# EAGLE board bm812inl (EAGLE 6.6.0), part 1 of 4
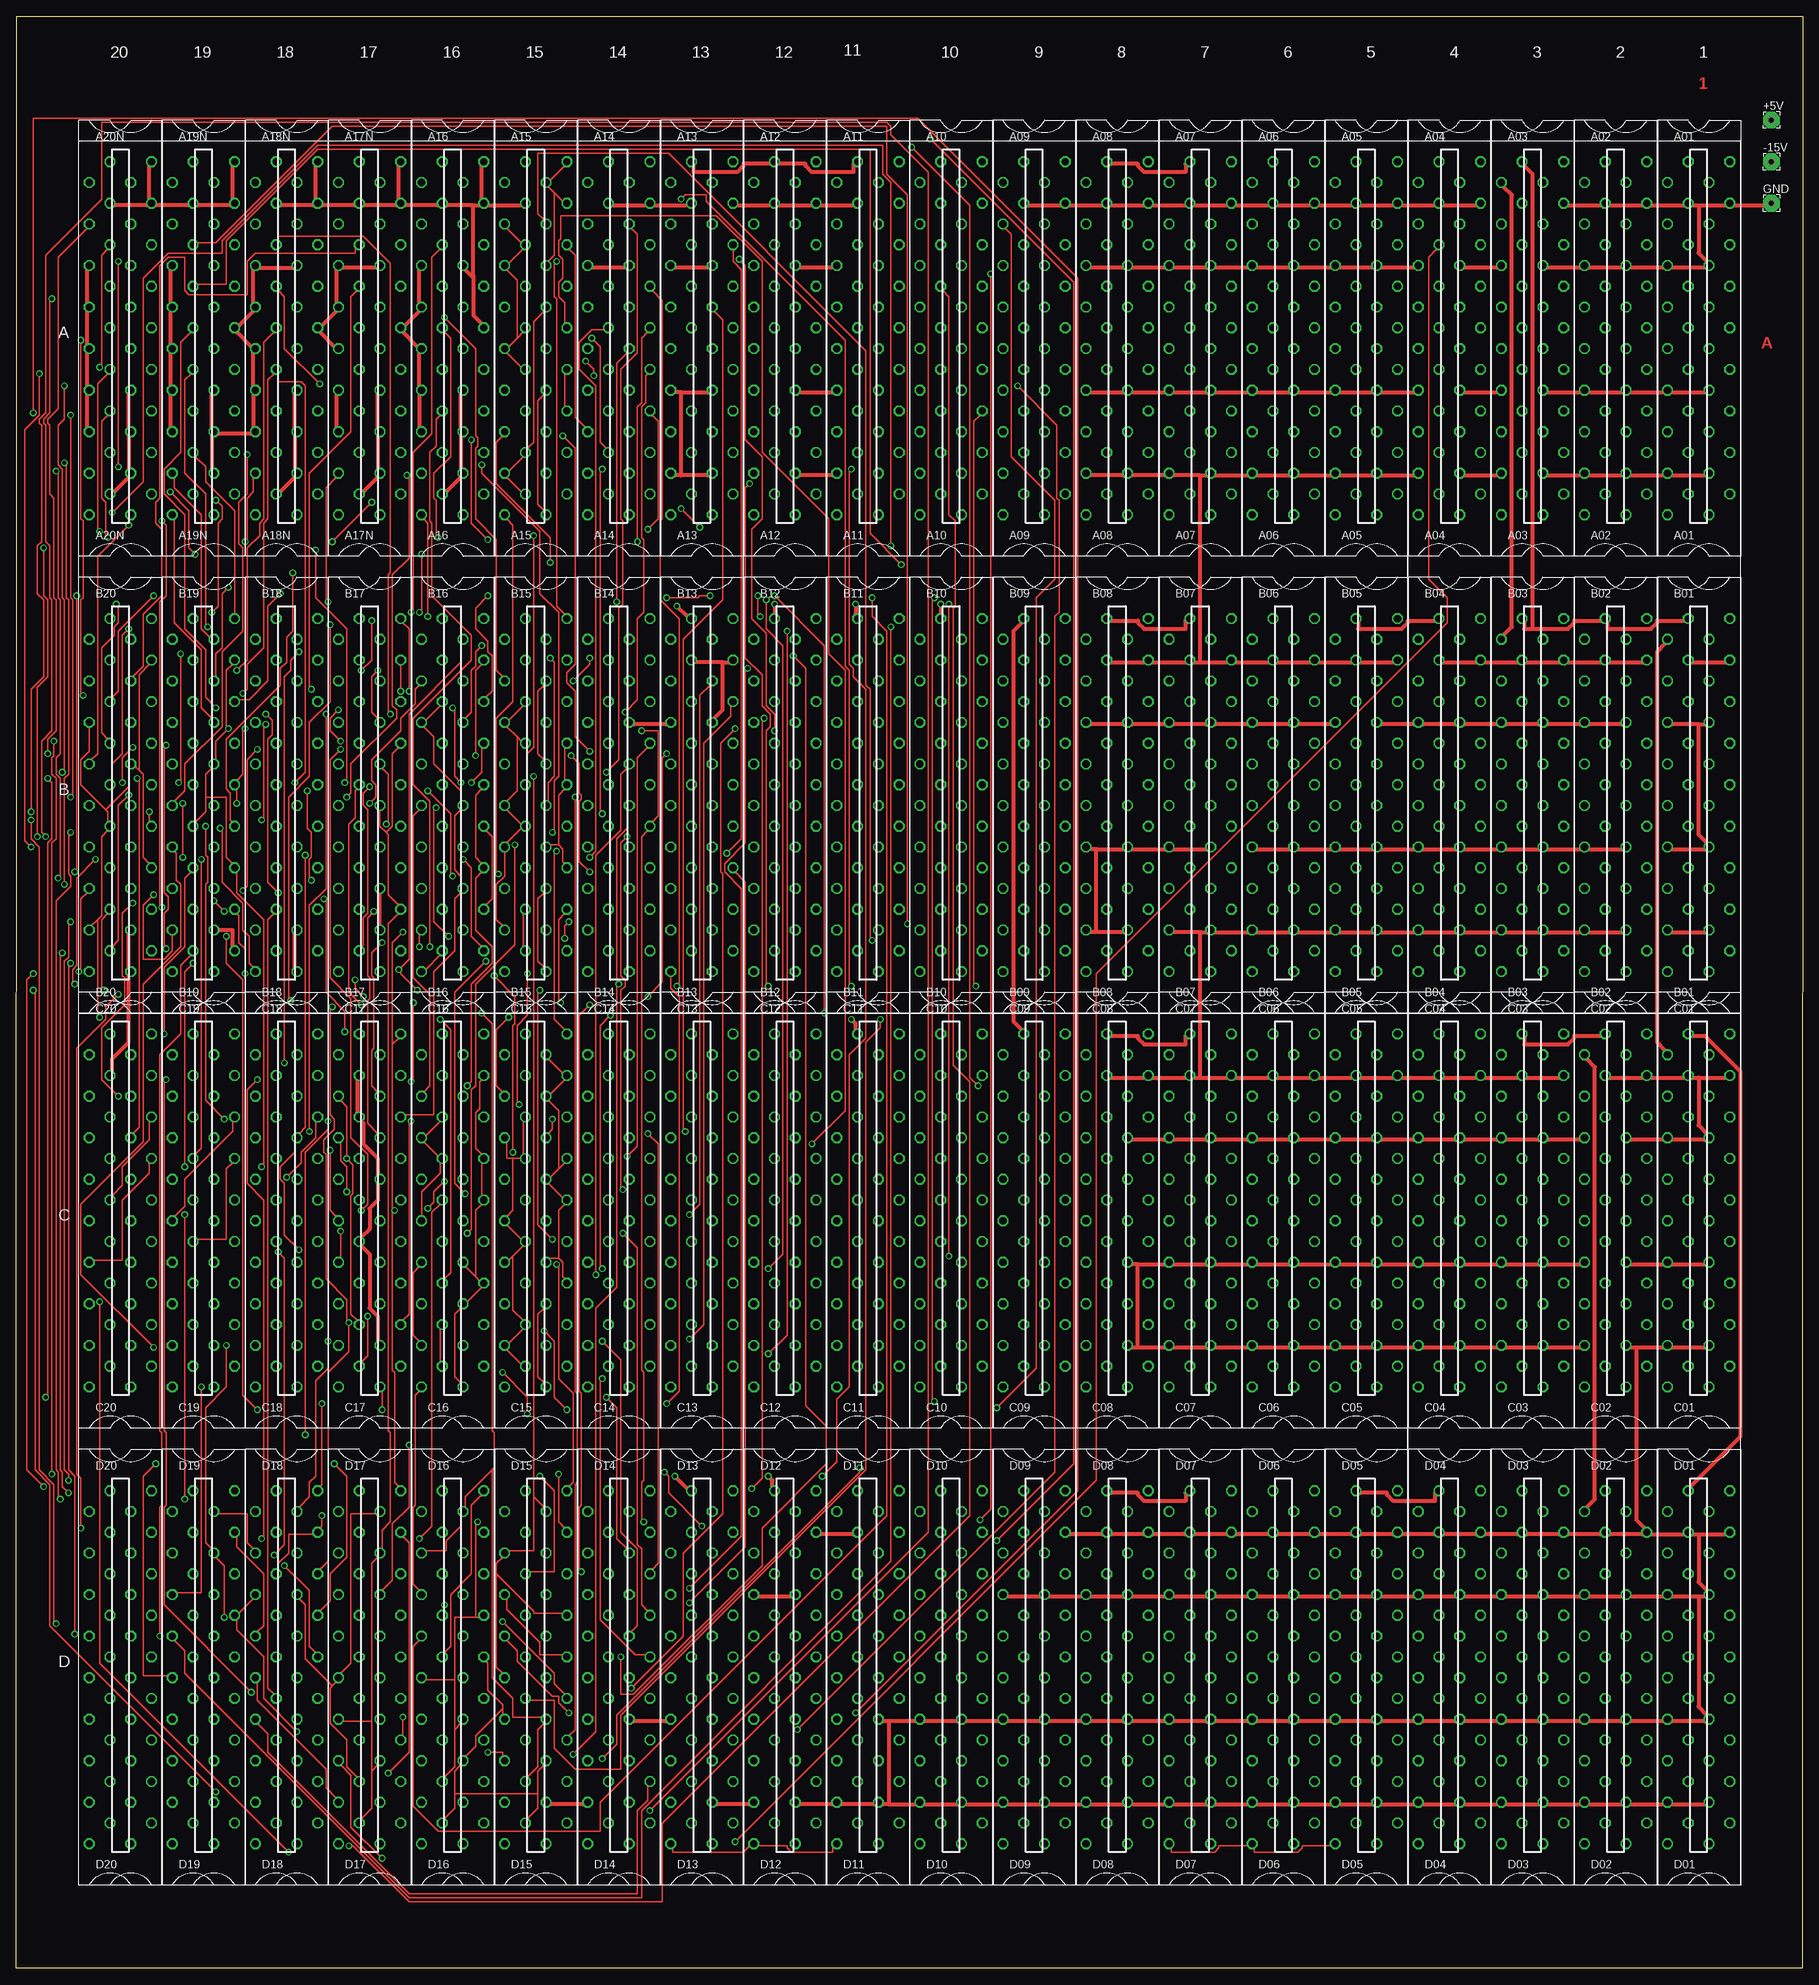
[diagram p5: board, top side]
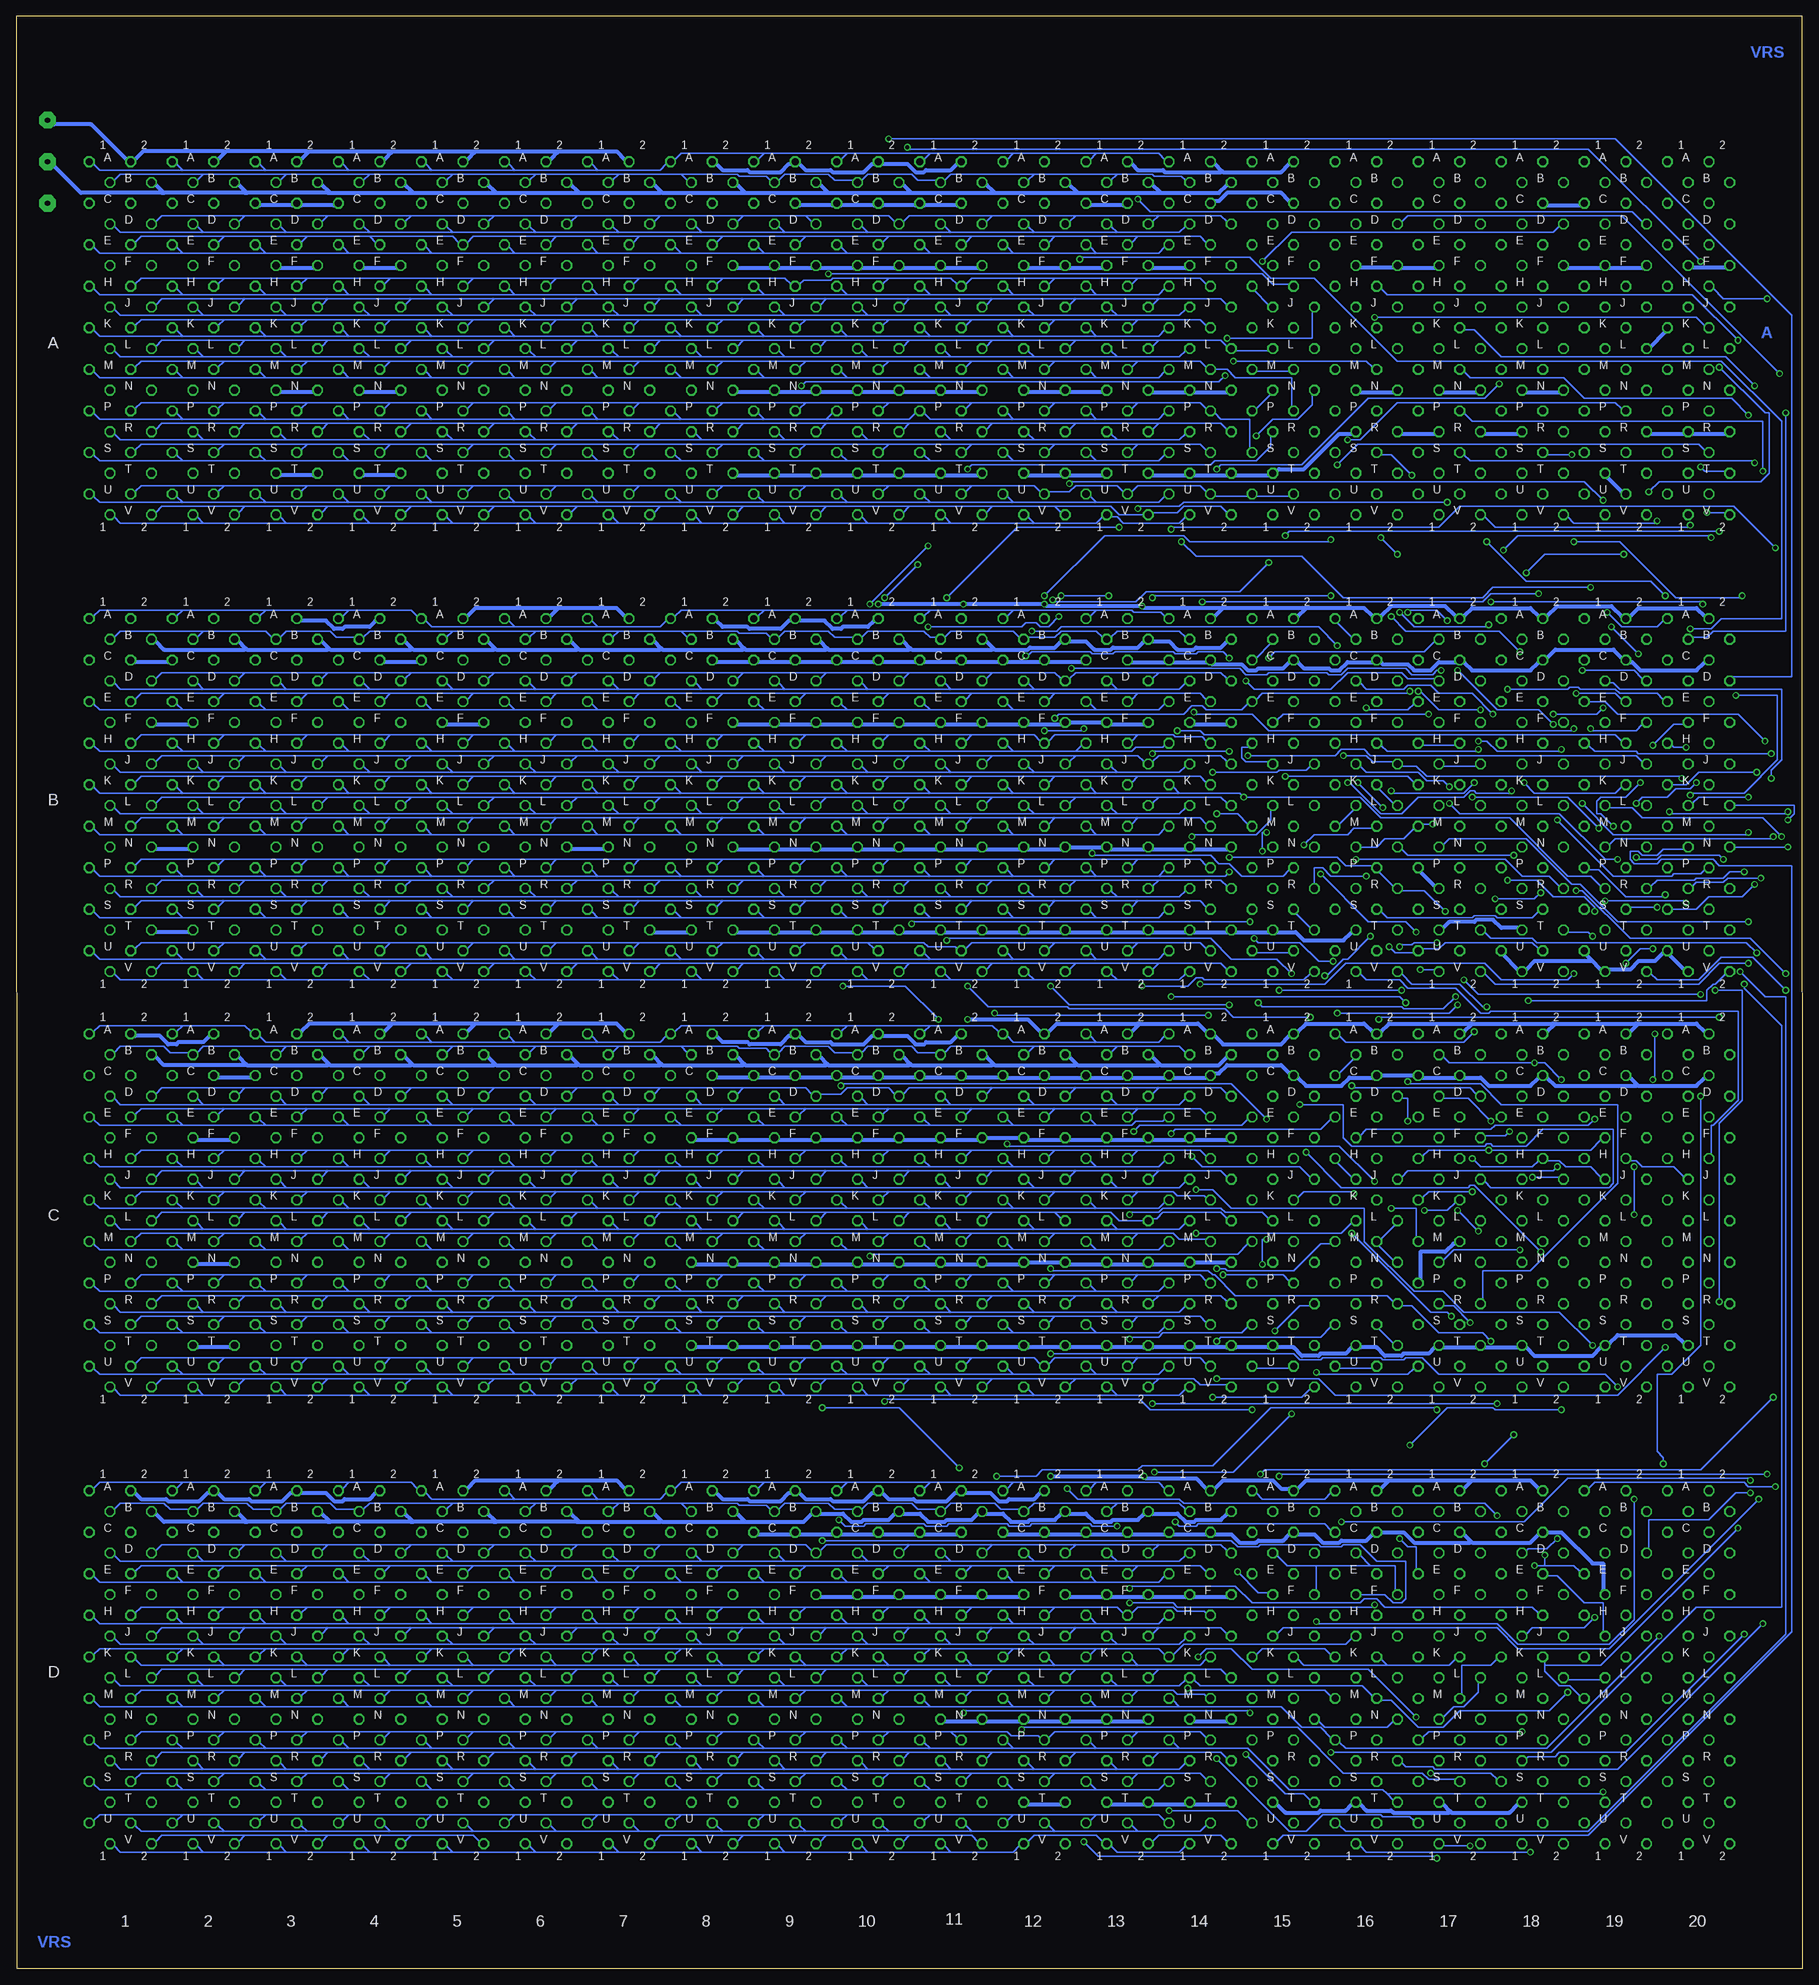
[diagram p6: board, bottom side, seen from below]

Size 273.11 x 298.44 mm. Coordinates in mm from the lower left corner, seen from the top.
Outline: 273.08,0 0,0 0.03,298.42 273.11,298.44 273.08,0
Copper layers (1*2*15*16): Top 0.035mm / dielectric 1.5mm / Route2 0.035mm / dielectric 0.15mm / Route15 0.035mm / dielectric 0.2mm / Bottom 0.035mm
Design rules "10mils": minimum track width 10mil, minimum drill 24mil, track to track 5mil, track to pad 10mil, pad to pad 10mil, via to via 5mil, smd to smd 10mil, copper to edge 40mil, drill to drill 10mil, minimum pad ring 10mil, minimum via ring 8mil, stop-mask expansion 0mil, vias tented up to drill 0mil, thermal gap 10mil
Net classes: 1 Power: width 0.635 mm

## Footprints (pad centres in the part's own frame; a part is rotated, then mirrored left to right if it is on the bottom)
2,54/0,8 = drill 0.813 pad 2.54 octagon: 1 0,0
H807 = drill 1.092 octagon: A1 4.763,28.575; A2 -1.587,28.575; B1 1.587,25.4; B2 -4.763,25.4; C1 4.763,22.225; C2 -1.587,22.225; D1 1.587,19.05; D2 -4.763,19.05; E1 4.763,15.875; E2 -1.587,15.875; F1 1.587,12.7; F2 -4.763,12.7; H1 4.763,9.525; H2 -1.587,9.525; J1 1.587,6.35; J2 -4.763,6.35; K1 4.763,3.175; K2 -1.587,3.175; L1 1.587,0; L2 -4.763,0; M1 4.763,-3.175; M2 -1.587,-3.175; N1 1.587,-6.35; N2 -4.763,-6.35; P1 4.763,-9.525; P2 -1.587,-9.525; R1 1.587,-12.7; R2 -4.763,-12.7; S1 4.763,-15.875; S2 -1.587,-15.875; T1 1.587,-19.05; T2 -4.763,-19.05; U1 4.763,-22.225; U2 -1.587,-22.225; V1 1.587,-25.4; V2 -4.763,-25.4

## Placement (x,y rotation side)
+5V  [2,54/0,8]  268.32,282.56 0 top
-15V  [2,54/0,8]  268.32,276.21 0 top
A01  M916  [H807]  257.21,247.64 0 top
A02  M916  [H807]  244.51,247.64 0 top
A03  M916  [H807]  231.81,247.64 0 top
A04  M916  [H807]  219.11,247.64 0 top
A05  M916  [H807]  206.41,247.64 0 top
A06  M916  [H807]  193.71,247.64 0 top
A07  M916  [H807]  181.01,247.64 0 top
A08  M916  [H807]  168.31,247.64 0 top
A09  M916  [H807]  155.61,247.64 0 top
A10  M916  [H807]  142.91,247.64 0 top
A11  M916  [H807]  130.21,247.64 0 top
A12  M916  [H807]  117.51,247.64 0 top
A13  M916  [H807]  104.81,247.64 0 top
A14  M916  [H807]  92.11,247.64 0 top
A15  M627  [H807]  79.41,247.64 0 top
A16  M903  [H807]  66.71,247.64 0 top
A17N  M903  [H807]  54.01,247.64 0 top
A18N  M903  [H807]  41.31,247.64 0 top
A19N  M903  [H807]  28.61,247.64 0 top
A20N  M903  [H807]  15.91,247.64 0 top
B01  M916  [H807]  257.21,177.79 0 top
B02  M916  [H807]  244.51,177.79 0 top
B03  M916  [H807]  231.81,177.79 0 top
B04  M916  [H807]  219.11,177.79 0 top
B05  M916  [H807]  206.41,177.79 0 top
B06  M916  [H807]  193.71,177.79 0 top
B07  M916  [H807]  181.01,177.79 0 top
B08  M916  [H807]  168.31,177.79 0 top
B09  M916  [H807]  155.61,177.79 0 top
B10  M916  [H807]  142.91,177.79 0 top
B11  M916  [H807]  130.21,177.79 0 top
B12  M916  [H807]  117.51,177.79 0 top
B13  M916  [H807]  104.81,177.79 0 top
B14  M916  [H807]  92.11,177.79 0 top
B15  M627  [H807]  79.41,177.79 0 top
B16  M115  [H807]  66.71,177.79 0 top
B17  M113  [H807]  54.01,177.79 0 top
B18  M623  [H807]  41.31,177.79 0 top
B19  M623  [H807]  28.61,177.79 0 top
B20  M623  [H807]  15.91,177.79 0 top
C01  M916  [H807]  257.21,114.29 0 top
C02  M916  [H807]  244.51,114.29 0 top
C03  M916  [H807]  231.81,114.29 0 top
C04  M916  [H807]  219.11,114.29 0 top
C05  M916  [H807]  206.41,114.29 0 top
C06  M916  [H807]  193.71,114.29 0 top
C07  M916  [H807]  181.01,114.29 0 top
C08  M916  [H807]  168.31,114.29 0 top
C09  M916  [H807]  155.61,114.29 0 top
C10  M916  [H807]  142.91,114.29 0 top
C11  M916  [H807]  130.21,114.29 0 top
C12  M916  [H807]  117.51,114.29 0 top
C13  M916  [H807]  104.81,114.29 0 top
C14  M916  [H807]  92.11,114.29 0 top
C15  M627  [H807]  79.41,114.29 0 top
C16  M627  [H807]  66.71,114.29 0 top
C17  M206X  [H807]  54.01,114.29 0 top
C18  M310  [H807]  41.31,114.29 0 top
C19  M310  [H807]  28.61,114.29 0 top
C20  M310  [H807]  15.91,114.29 0 top
D01  M916  [H807]  257.21,44.44 0 top
D02  M916  [H807]  244.51,44.44 0 top
D03  M916  [H807]  231.81,44.44 0 top
D04  M916  [H807]  219.11,44.44 0 top
D05  M916  [H807]  206.41,44.44 0 top
D06  M916  [H807]  193.71,44.44 0 top
D07  M916  [H807]  181.01,44.44 0 top
D08  M916  [H807]  168.31,44.44 0 top
D09  M916  [H807]  155.61,44.44 0 top
D10  M916  [H807]  142.91,44.44 0 top
D11  M916  [H807]  130.21,44.44 0 top
D12  M916  [H807]  117.51,44.44 0 top
D13  M916  [H807]  104.81,44.44 0 top
D14  M916  [H807]  92.11,44.44 0 top
D15  M206X  [H807]  79.41,44.44 0 top
D16  M206X  [H807]  66.71,44.44 0 top
D17  M206X  [H807]  54.01,44.44 0 top
D18  M111  [H807]  41.31,44.44 0 top
D19  M921  [H807]  28.61,44.44 0 top
D20  H807  [H807]  15.91,44.44 0 top
GND  [2,54/0,8]  268.32,269.86 0 top
U$1  [CBLOCK]  9.56,146.04 0 top
U$2  [CBLOCK]  60.36,146.04 0 top
U$3  [CBLOCK]  111.16,146.04 0 top
U$4  [CBLOCK]  161.96,146.04 0 top
U$5  [CBLOCK]  212.76,146.04 0 top
U$6  [CBLOCK]  9.56,12.69 0 top
U$7  [CBLOCK]  60.36,12.69 0 top
U$8  [CBLOCK]  111.16,12.69 0 top
U$9  [CBLOCK]  161.96,12.69 0 top
U$10  [CBLOCK]  212.76,12.69 0 top

## Tracks (layer width: path | path; a pad name or v marks a point on that pad's centre or on a via)
-15V
  Top 0.635: D02.B2 240.07,70.47 241.34,71.74 241.34,137.78 240.07,139.05 C02.B2 | B01.B2 252.13,202.55 250.86,201.28 250.86,141.59 252.13,140.32 C01.B2 | A03.B2 227.37,272.4 228.64,271.13 228.64,205.09 227.37,203.82 B03.B2
  Bottom 0.635: 98.3,271.61 99.41,272.72 A13.B2 | 98.3,271.61 98.14,271.45 89.25,271.45 87.98,272.72 A14.B2 | 111,271.61 110.84,271.45 98.46,271.45 98.3,271.61 | 111,271.61 112.11,272.72 A12.B2 | 123.7,271.61 123.54,271.45 111.16,271.45 111,271.61 | 123.7,271.61 124.81,272.72 A11.B2 | 136.4,271.61 136.24,271.45 123.86,271.45 123.7,271.61 | 136.4,271.61 137.51,272.72 A10.B2 | 149.1,271.61 148.94,271.45 136.56,271.45 136.4,271.61 | 149.1,271.61 150.21,272.72 A09.B2 | 161.8,271.61 161.64,271.45 149.26,271.45 149.1,271.61 | 161.8,271.61 162.91,272.72 A08.B2 | 174.5,271.61 174.34,271.45 161.96,271.45 161.8,271.61 | 174.5,271.61 175.61,272.72 A07.B2 | 187.2,271.61 187.04,271.45 174.66,271.45 174.5,271.61 | 187.2,271.61 188.31,272.72 A06.B2 | 199.9,271.61 199.74,271.45 187.36,271.45 187.2,271.61 | 199.9,271.61 201.01,272.72 A05.B2 | 212.6,271.61 212.44,271.45 200.06,271.45 199.9,271.61 | 212.6,271.61 213.71,272.72 A04.B2 | 225.3,271.61 225.14,271.45 212.76,271.45 212.6,271.61 | 225.3,271.61 226.41,272.72 A03.B2 | 238,271.61 237.84,271.45 225.46,271.45 225.3,271.61 | 238,271.61 239.11,272.72 A02.B2 | 250.7,271.61 250.54,271.45 238.16,271.45 238,271.61 | 250.7,271.61 251.81,272.72 A01.B2 | -15V.1 267.37,275.58 263.24,271.45 250.86,271.45 250.7,271.61 | B14.B2 87.98,202.87 88.94,201.92 92.75,201.92 93.06,201.6 95.6,201.6 96.87,202.87 99.41,202.87 B13.B2 100.68,202.87 101.64,201.92 105.45,201.92 105.76,201.6 108.3,201.6 109.57,202.87 112.11,202.87 B12.B2 113.38,202.87 114.34,201.92 118.15,201.92 118.46,201.6 123.54,201.6 123.7,201.76 | 123.7,201.76 124.81,202.87 B11.B2 | 136.4,201.76 136.24,201.6 123.86,201.6 123.7,201.76
  Bottom 0.635: 136.4,201.76 137.51,202.87 B10.B2 | 149.1,201.76 148.94,201.6 136.56,201.6 136.4,201.76 | 149.1,201.76 150.21,202.87 B09.B2 | 161.8,201.76 161.64,201.6 149.26,201.6 149.1,201.76 | 161.8,201.76 162.91,202.87 B08.B2 | 174.5,201.76 174.34,201.6 161.96,201.6 161.8,201.76 | 174.5,201.76 175.61,202.87 B07.B2 | 187.2,201.76 187.04,201.6 174.66,201.6 174.5,201.76 | 187.2,201.76 188.31,202.87 B06.B2 | 199.9,201.76 199.74,201.6 187.36,201.6 187.2,201.76 | 199.9,201.76 201.01,202.87 B05.B2 | 212.6,201.76 212.44,201.6 200.06,201.6 199.9,201.76 | 212.6,201.76 213.71,202.87 B04.B2 | 225.3,201.76 225.14,201.6 212.76,201.6 212.6,201.76 | 225.3,201.76 226.41,202.87 B03.B2 | 238,201.76 237.84,201.6 225.46,201.6 225.3,201.76 | 238,201.76 239.11,202.87 B02.B2 | B01.B2 251.81,202.87 250.54,201.6 238.16,201.6 238,201.76 | D14.B2 87.98,69.52 88.94,68.57 92.75,68.57 93.06,68.25 94.33,68.25 95.6,69.52 99.41,69.52 D13.B2 100.68,69.52 101.64,68.57 105.45,68.57 105.76,68.25 108.3,68.25 109.57,69.52 112.11,69.52 D12.B2 113.38,69.52 114.34,68.57 118.15,68.57 118.46,68.25 121,68.25 122.27,69.52 124.81,69.52 D11.B2 126.08,69.52 127.04,68.57 130.85,68.57 131.16,68.25 133.7,68.25 134.97,69.52 137.51,69.52 D10.B2 138.78,69.52 139.74,68.57 143.55,68.57 143.86,68.25 145.45,68.25 146.72,69.52 150.21,69.52 D09.B2 151.48,69.52 152.75,68.25 161.64,68.25 161.8,68.41 | 161.8,68.41 162.91,69.52 D08.B2 | 174.5,68.41 174.34,68.25 161.96,68.25 161.8,68.41 | 174.5,68.41 175.61,69.52 D07.B2 | 187.2,68.41 187.04,68.25 174.66,68.25 174.5,68.41 | 187.2,68.41 188.31,69.52 D06.B2 | 199.9,68.41 199.74,68.25 187.36,68.25 187.2,68.41
  Bottom 0.635: 199.9,68.41 201.01,69.52 D05.B2 | 212.6,68.41 212.44,68.25 200.06,68.25 199.9,68.41 | 212.6,68.41 213.71,69.52 D04.B2 | 225.3,68.41 225.14,68.25 212.76,68.25 212.6,68.41 | 225.3,68.41 226.41,69.52 D03.B2 | 238,68.41 237.84,68.25 225.46,68.25 225.3,68.41 | 238,68.41 239.11,69.52 D02.B2 | D01.B2 251.81,69.52 250.54,68.25 238.16,68.25 238,68.41 | 98.3,138.26 99.41,139.37 C13.B2 | 98.3,138.26 98.14,138.1 89.25,138.1 87.98,139.37 C14.B2 | 111,138.26 110.84,138.1 98.46,138.1 98.3,138.26 | 111,138.26 112.11,139.37 C12.B2 | 123.7,138.26 123.54,138.1 111.16,138.1 111,138.26 | 123.7,138.26 124.81,139.37 C11.B2 | 136.4,138.26 136.24,138.1 123.86,138.1 123.7,138.26 | 136.4,138.26 137.51,139.37 C10.B2 | 149.1,138.26 148.94,138.1 136.56,138.1 136.4,138.26 | 149.1,138.26 150.21,139.37 C09.B2 | 161.8,138.26 161.64,138.1 149.26,138.1 149.1,138.26 | 161.8,138.26 162.91,139.37 C08.B2 | 174.5,138.26 174.34,138.1 161.96,138.1 161.8,138.26 | 174.5,138.26 175.61,139.37 C07.B2 | 187.2,138.26 187.04,138.1 174.66,138.1 174.5,138.26 | 187.2,138.26 188.31,139.37 C06.B2 | 199.9,138.26 199.74,138.1 187.36,138.1 187.2,138.26 | 199.9,138.26 201.01,139.37 C05.B2 | 212.6,138.26 212.44,138.1 200.06,138.1 199.9,138.26 | 212.6,138.26 213.71,139.37 C04.B2 | 225.3,138.26 225.14,138.1 212.76,138.1 212.6,138.26 | 225.3,138.26 226.41,139.37 C03.B2 | 238,138.26 237.84,138.1 225.46,138.1 225.3,138.26 | 238,138.26 239.11,139.37 C02.B2 | C01.B2 251.81,139.37 250.54,138.1 238.16,138.1 238,138.26
A15U1
  Top 0.254: 82.27,271.45 83.54,270.18 A15.C1 | 82.27,271.45 81.32,272.4 A15.B1 81.63,273.36 83.86,275.58 A15.A1 | 82.27,271.45 82.27,261.93 81.32,260.97 A15.F1 80.68,259.7 80.68,254.62 A15.J1 80.68,253.35 79.09,251.77 79.09,233.35 78.14,232.4 A15.S2 77.51,231.13 75.28,228.9 A15.T2 74.97,227.95 77.19,225.73 A15.U2
  Bottom 0.254: A15.J1 81.63,254.3 83.86,256.53 A15.H1 | A15.U2 78.46,225.09 83.54,225.09 A15.U1 84.81,225.09 89.89,225.09 A14.U2 91.16,225.73 92.11,226.68 101.64,226.68 102.59,225.73 A13.U2 103.86,225.73 104.81,226.68 111.16,226.68 112.11,225.73 115.29,225.73 A12.U2 116.56,225.73 117.51,226.68 127.04,226.68 | 127.04,226.68 127.99,225.73 A11.U2 | 139.74,226.68 140.69,225.73 A10.U2 | 127.04,226.68 139.74,226.68 | 152.44,226.68 153.39,225.73 A09.U2 | 139.74,226.68 152.44,226.68 | 165.14,226.68 166.09,225.73 A08.U2 | 152.44,226.68 165.14,226.68 | 177.84,226.68 178.79,225.73 A07.U2 | 165.14,226.68 177.84,226.68 | 190.54,226.68 191.49,225.73 A06.U2 | 177.84,226.68 190.54,226.68 | 203.24,226.68 204.19,225.73 A05.U2 | 190.54,226.68 203.24,226.68 | 215.94,226.68 216.89,225.73 A04.U2 | 203.24,226.68 215.94,226.68 | 228.64,226.68 229.59,225.73 A03.U2 | 215.94,226.68 228.64,226.68 | 241.34,226.68 242.29,225.73 A02.U2 | 228.64,226.68 241.34,226.68 | 241.34,226.68 254.04,226.68 254.99,225.73 A01.U2
A15V1
  Top 0.254: A15.D2 74.97,266.05 77.19,263.83 A15.E2 77.51,262.88 75.28,260.66 A15.F2 74.97,259.7 76.55,258.11 76.55,249.23 | A15.M2 77.19,244.78 74.97,247 A15.L2 75.28,247.96 76.55,249.23 | 76.55,249.23 77.51,250.18 A15.K2 | A15.V1 80.68,222.87 79.73,223.83 79.73,239.7 80.68,240.65 A15.N1 | A15.M1 83.86,243.83 83.86,238.75 A15.P1
  Bottom 0.254: A15.P1 83.54,238.43 81.32,240.65 A15.N1 | A15.M2 78.46,244.14 83.54,244.14 A15.M1
B17S1
  Top 0.254: 56.55,173.66 55.6,174.61 B17.L1 | 56.55,173.66 56.87,173.34 56.87,164.14 58.46,162.55 B17.S1 58.46,161.28 56.87,159.69 56.87,82.22 57.19,81.9 57.19,68.25 55.92,66.98 55.92,64.12 D17.D1 55.28,62.85 54.33,61.9 54.33,37.77 | 56.55,173.66 57.5,174.61 57.5,185.73 58.46,186.68 B17.H1 | 54.33,30.15 54.33,24.44 52.74,22.85 D17.U2 | 54.33,30.15 55.28,31.1 D17.R1 | 54.33,37.77 49.88,37.77 D17.N2 | 54.33,30.15 54.33,37.77
  Bottom 0.254: B17.H2 53.06,186.99 58.14,186.99 B17.H1
B17V1  (via drill 0.61)
  Top 0.254: D16.A1 71.16,72.38 69.57,70.79 69.57,60.31 66.39,57.14 66.39,49.2 65.44,48.25 D16.K2 | B16.B1 67.98,202.55 67.98,199.7 60.04,191.76 60.04,154.29 v58.46,152.71 58.77,152.39 58.77,152.07 v61.31,149.53 | v82.59,107.62 82.9,107.3 82.9,90.16 85.13,87.94 85.13,74.28 84.49,73.65 D15.A1 | v81.95,111.43 79.73,113.65 79.73,149.21 v80.05,149.53
  Bottom 0.254: D16.A1 72.11,72.69 73.06,71.74 82.59,71.74 83.54,72.69 D15.A1 | 63.54,46.34 54.01,46.34 53.06,47.29 D17.K2 | 63.54,46.34 64.49,47.29 D16.K2 | 63.54,46.34 76.24,46.34 77.19,47.29 D15.K2 | v58.46,152.71 56.23,152.71 B17.V1 | B16.A1 71.16,205.73 68.93,203.51 B16.B1 | v82.59,107.62 82.59,111.43 v81.95,111.43 | v61.31,149.53 v80.05,149.53
C16U1
  Top 0.254: C16.U2 64.81,92.7 64.81,97.78 C16.S2 | C16.E2 64.81,129.53 62.58,127.3 C16.F2 62.27,126.35 64.49,124.13 C16.H2 64.81,123.18 64.81,121.59 61.95,118.73 C16.L2 | C16.T2 61.63,95.87 60.68,96.83 60.68,106.35 61.63,107.3 C16.N2
  Bottom 0.254: C16.U2 65.76,91.74 70.84,91.74 C16.U1 | C16.T2 62.58,95.55 64.81,97.78 C16.S2 | C16.N2 62.58,108.25 64.81,110.48 C16.M2 64.49,111.43 62.27,113.65 C16.L2
D01BINIT  (via drill 0.61)
  Top 0.254: v47.66,95.87 47.66,91.74 45.76,89.84 45.76,75.24 44.8,74.28 44.8,72.06 43.22,70.47 D18.B1 | v81.63,214.93 81.63,218.74 73.38,227 73.38,233.35 74.33,234.3 A15.R2 | v114.65,209.22 114.65,204.77 117.19,202.24 117.19,109.21 v114.97,106.99
  Bottom 0.254: v47.66,95.87 48.93,97.14 55.6,97.14 59.73,101.27 61.31,101.27 C16.R2 62.58,101.91 63.54,102.86 86.71,102.86 89.89,106.03 90.21,106.03 90.84,106.67 114.65,106.67 v114.97,106.99 | v81.63,214.93 86.08,210.49 100.37,210.49 101.95,208.9 114.34,208.9 v114.65,209.22
D01BTP2L  (via drill 0.61)
  Top 0.254: B16.V2 62.58,152.71 64.81,154.93 B16.U2 | D18.E1 46.39,60.95 47.66,62.22 47.66,91.11 50.84,94.28 v50.84,98.73 50.52,99.05 50.52,102.22 47.34,105.4 47.34,124.45 47.03,124.77 47.03,126.67 48.61,128.26 48.61,129.84 47.98,130.48 47.98,146.67 v48.3,146.99
  Bottom 0.254: v50.84,98.73 53.38,101.27 54.96,101.27 C17.R1 | v48.3,146.99 48.93,146.99 52.42,150.48 59.73,150.48 61.31,152.07 B16.V2
D01DEL1H  (via drill 0.61)
  Top 0.254: v18.45,181.92 18.77,181.6 18.77,128.58 17.82,127.62 C20.F1 | v70.2,185.41 70.2,198.43 71.16,199.38 B16.C1
  Bottom 0.254: v18.45,181.92 18.77,182.23 57.5,182.23 59.09,183.82 61.31,183.82 B16.J2 62.58,184.46 65.76,184.46 66.71,185.41 v70.2,185.41
D01DEL1L  (via drill 0.61)
  Top 0.254: v50.52,118.73 50.52,122.54 49.57,123.49 49.57,126.35 C17.F2 | v47.34,191.76 47.34,165.09 44.8,162.55 v44.8,127.94
  Bottom 0.254: v50.52,118.73 57.19,118.73 58.14,117.78 C17.K1 | v47.34,191.76 50.52,194.93 55.6,194.93 56.87,196.2 60.36,196.2 61,195.57 66.71,195.57 67.66,196.52 B16.D1 | v44.8,127.94 45.44,127.3 48.61,127.3 C17.F2
D01DEL2  (via drill 0.61)
  Top 0.254: v54.01,178.11 54.96,179.06 54.96,180.96 54.33,181.6 54.33,184.77 58.77,189.22 58.77,191.12 61,193.34 61,195.57 61.63,196.2 B16.D2 | v28.29,169.53 28.29,125.4 27.34,124.45 C19.H2
  Bottom 0.254: C20.J1 18.13,120.96 19.72,122.54 24.48,122.54 25.44,123.49 26.39,123.49 C19.H2 | v54.01,178.11 52.42,176.52 37.18,176.52 30.2,169.53 v28.29,169.53
D01DEL3  (via drill 0.61)
  Top 0.254: v47.98,125.08 47.98,115.88 48.93,114.92 C17.L2
  Bottom 0.254: C19.F1 30.83,126.67 32.42,125.08 v47.98,125.08 57.19,125.08 58.14,124.13 C17.H1
D01DEL4  (via drill 0.61)
  Top 0.254: B16.K1 71.16,180.33 70.2,179.37 70.2,169.85 71.16,168.9 B16.P1 71.16,167.63 70.2,166.68 70.2,158.74 72.74,156.2 72.74,153.66 69.57,150.48 69.57,135.56 v68.93,134.93 | C17.S2 52.11,99.05 51.15,100 51.15,118.1 51.47,118.41 51.47,122.86 v50.52,123.81 50.52,131.75 49.57,132.7 C17.D2
  Bottom 0.254: C19.J1 30.83,120.96 32.42,122.54 36.23,122.54 37.18,123.49 39.09,123.49 C18.H2 40.36,123.49 41.31,122.54 49.25,122.54 v50.52,123.81 | v68.93,134.93 68.62,134.61 50.84,134.61 49.88,133.65 C17.D2
D01DEL5  (via drill 0.61)
  Top 0.254: v43.22,109.84 40.99,112.07 40.99,120 40.36,120.64 40.36,122.54 42.58,124.77 42.58,126.35 C18.F1 43.22,127.62 44.17,128.58 v44.17,170.17
  Bottom 0.254: v43.22,109.84 53.38,109.84 54.96,108.25 C17.N1 | v44.17,170.17 60.36,170.17 61.31,171.12 B16.N2
D01DONEH
  Top 0.254: D18.N2 36.87,37.45 38.45,35.86 38.45,33.01 60.04,11.42 94.97,11.42 94.97,24.12 96.56,25.71 96.56,27.93 D14.S1
  Bottom 0.254: 107.99,27.29 98.46,27.29 97.51,28.25 D14.S1 | 107.99,27.29 108.94,28.25 D13.S1 | 120.69,27.29 121.64,28.25 D12.S1 | 120.69,27.29 107.99,27.29 | 133.39,27.29 134.34,28.25 D11.S1 | 133.39,27.29 120.69,27.29 | 146.09,27.29 147.04,28.25 D10.S1 | 146.09,27.29 133.39,27.29 | 158.79,27.29 159.74,28.25 D09.S1 | 158.79,27.29 146.09,27.29 | 171.49,27.29 172.44,28.25 D08.S1 | 171.49,27.29 158.79,27.29 | 184.19,27.29 185.14,28.25 D07.S1 | 184.19,27.29 171.49,27.29 | 196.89,27.29 197.84,28.25 D06.S1 | 196.89,27.29 184.19,27.29 | 209.59,27.29 210.54,28.25 D05.S1 | 209.59,27.29 196.89,27.29 | 222.29,27.29 223.24,28.25 D04.S1 | 222.29,27.29 209.59,27.29 | 234.99,27.29 235.94,28.25 D03.S1 | 234.99,27.29 222.29,27.29 | 247.69,27.29 248.64,28.25 D02.S1 | 234.99,27.29 247.69,27.29 | 247.69,27.29 260.39,27.29 261.34,28.25 D01.S1
D01DONEL
  Top 0.254: D18.M2 39.41,41.9 38.45,42.85 38.45,160.33 39.41,161.28 B18.S2
  Bottom 0.254: B16.S2 64.49,161.59 63.54,160.64 50.52,160.64 50.2,160.96 47.03,160.96 46.71,160.64 41.31,160.64 40.36,161.59 B18.S2
D01INHIBIT
  Bottom 0.254: A15.S1 84.49,232.4 84.49,236.84 88.94,236.84 89.89,237.8 A14.P2 91.16,238.43 92.11,239.38 101.64,239.38 | 101.64,239.38 102.59,238.43 A13.P2 | 114.34,239.38 115.29,238.43 A12.P2 | 101.64,239.38 114.34,239.38 | 127.04,239.38 127.99,238.43 A11.P2 | 114.34,239.38 127.04,239.38 | 139.74,239.38 140.69,238.43 A10.P2 | 127.04,239.38 139.74,239.38 | 152.44,239.38 153.39,238.43 A09.P2 | 139.74,239.38 152.44,239.38 | 165.14,239.38 166.09,238.43 A08.P2 | 152.44,239.38 165.14,239.38 | 177.84,239.38 178.79,238.43 A07.P2 | 165.14,239.38 177.84,239.38 | 190.54,239.38 191.49,238.43 A06.P2 | 177.84,239.38 190.54,239.38 | 203.24,239.38 204.19,238.43 A05.P2 | 190.54,239.38 203.24,239.38 | 215.94,239.38 216.89,238.43 A04.P2 | 203.24,239.38 215.94,239.38 | 228.64,239.38 229.59,238.43 A03.P2 | 215.94,239.38 228.64,239.38 | 241.34,239.38 242.29,238.43 A02.P2 | 228.64,239.38 241.34,239.38 | 241.34,239.38 254.04,239.38 254.99,238.43 A01.P2
D01INITL  (via drill 0.61)
  Top 0.254: 57.5,141.27 57.5,116.19 v57.82,115.88 57.5,115.56 57.5,91.43 57.82,91.11 57.82,74.28 58.46,73.65 D17.A1 | 57.5,141.27 58.46,142.23 C17.A1 | v73.7,167.31 73.38,167.63 73.38,191.12 75.92,193.66 75.92,220.65 74.97,221.6 A15.V2 | v59.09,158.42 57.5,156.83 57.5,141.27
  Bottom 0.254: v57.82,115.88 54.33,115.88 53.06,117.14 C17.K2 | v73.7,167.31 66.39,160.01 60.68,160.01 v59.09,158.42
D01LOADMDL  (via drill 0.61)
  Top 0.254: v56.55,174.93 56.87,175.25 56.87,182.55 55.92,183.5 B17.J1
  Bottom 0.254: B17.J2 49.88,183.82 54.96,183.82 B17.J1 | B16.N1 65.12,171.44 63.85,172.71 61,172.71 59.41,174.3 B17.M1 58.14,174.93 v56.55,174.93
D01MEMDONEL  (via drill 0.61)
  Top 0.254: v31.15,174.3 31.47,173.98 31.47,166.04 34.64,162.86 34.64,158.74 35.6,157.79 35.6,153.66 36.23,153.02 B18.V2 | v50.52,179.06 51.15,179.69 51.15,184.14 58.14,191.12 58.14,192.39 57.5,193.03 57.5,213.03 60.04,215.57 60.04,227.95 v59.73,228.27
  Bottom 0.254: v31.15,174.3 35.91,179.06 v50.52,179.06 | v59.73,228.27 62.9,231.45 64.49,231.45 A16.S2
D01MEMSTARTL  (via drill 0.61)
  Top 0.254: v48.61,77.14 50.52,75.24 50.52,62.85 47.98,60.31 47.98,56.18 46.39,54.6 D18.H1 | v44.17,81.58 44.17,124.77 47.66,128.26 v47.66,129.53 | v61.63,156.2 61.63,158.1 B16.T2 | v55.92,156.83 54.33,155.24 54.33,151.75 54.65,151.43 54.65,140.64 54.33,140.32 54.33,134.93 55.28,133.97 C17.D1
  Bottom 0.254: v48.61,77.14 v44.17,81.58 | v47.66,129.53 51.15,133.02 54.96,133.02 C17.D1 | v61.63,156.2 61.31,156.52 59.73,156.52 59.41,156.83 v55.92,156.83
D01POWEROK  (via drill 0.61)
  Top 0.254: v46.71,86.35 46.71,73.97 46.39,73.65 D18.A1 | v99.41,86.35 101.32,88.25 101.32,148.58 100.05,149.85 B13.V2
  Bottom 0.254: v99.41,86.35 v46.71,86.35 | 98.46,153.66 88.94,153.66 87.98,152.71 B14.V2 | 98.46,153.66 99.41,152.71 B13.V2 | 111.16,153.66 112.11,152.71 B12.V2 | 111.16,153.66 98.46,153.66 | 123.86,153.66 124.81,152.71 B11.V2 | 111.16,153.66 123.86,153.66 | 136.56,153.66 137.51,152.71 B10.V2 | 123.86,153.66 136.56,153.66 | 149.26,153.66 150.21,152.71 B09.V2 | 136.56,153.66 149.26,153.66 | 161.96,153.66 162.91,152.71 B08.V2 | 149.26,153.66 161.96,153.66 | 174.66,153.66 175.61,152.71 B07.V2 | 161.96,153.66 174.66,153.66 | 187.36,153.66 188.31,152.71 B06.V2 | 174.66,153.66 187.36,153.66 | 200.06,153.66 201.01,152.71 B05.V2 | 187.36,153.66 200.06,153.66 | 212.76,153.66 213.71,152.71 B04.V2 | 200.06,153.66 212.76,153.66 | 225.46,153.66 226.41,152.71 B03.V2 | 212.76,153.66 225.46,153.66 | 238.16,153.66 239.11,152.71 B02.V2 | 225.46,153.66 238.16,153.66 | 238.16,153.66 250.86,153.66 251.81,152.71 B01.V2
D01READH
  Top 0.254: B16.E2 64.81,193.03 62.58,190.8 B16.F2 62.27,189.85 63.85,188.27 63.85,184.14 67.98,180.01 67.98,178.42 B16.L1 67.98,177.15 67.03,176.2 67.03,167.95 67.98,166.99 67.98,165.72 B16.R1 67.98,164.45 67.03,163.5 67.03,155.56 63.85,152.39 63.85,130.48 59.41,130.48 C17.E1 | B16.S1 71.79,162.55 72.74,163.5 72.74,173.02 71.79,173.98 B16.M1
  Bottom 0.254: B16.L1 68.62,177.15 70.84,174.93 B16.M1
D01READL  (via drill 0.61)
  Top 0.254: v54.65,161.59 53.69,160.64 53.69,151.75 54.01,151.43 54.01,148.26 53.69,147.94 53.69,129.21 55.28,127.62 C17.F1 | v87.67,169.85 88.62,170.8 88.62,241.92 86.08,244.46 86.08,248.59 87.98,250.49 89.89,250.49 A14.K2
  Bottom 0.254: v54.65,161.59 57.82,164.77 61.31,164.77 B16.R2 62.58,165.4 64.81,167.63 B16.P2 65.76,168.58 69.89,168.58 71.16,169.85 v87.67,169.85 | 101.64,252.08 92.11,252.08 91.16,251.13 A14.K2 | 101.64,252.08 102.59,251.13 A13.K2 | 114.34,252.08 115.29,251.13 A12.K2 | 101.64,252.08 114.34,252.08 | 127.04,252.08 127.99,251.13 A11.K2 | 114.34,252.08 127.04,252.08 | 139.74,252.08 140.69,251.13 A10.K2 | 127.04,252.08 139.74,252.08 | 152.44,252.08 153.39,251.13 A09.K2 | 139.74,252.08 152.44,252.08 | 165.14,252.08 166.09,251.13 A08.K2 | 152.44,252.08 165.14,252.08 | 177.84,252.08 178.79,251.13 A07.K2 | 165.14,252.08 177.84,252.08 | 190.54,252.08 191.49,251.13 A06.K2 | 177.84,252.08 190.54,252.08 | 203.24,252.08 204.19,251.13 A05.K2 | 190.54,252.08 203.24,252.08 | 215.94,252.08 216.89,251.13 A04.K2 | 203.24,252.08 215.94,252.08 | 228.64,252.08 229.59,251.13 A03.K2 | 215.94,252.08 228.64,252.08 | 241.34,252.08 242.29,251.13 A02.K2 | 228.64,252.08 241.34,252.08 | 241.34,252.08 254.04,252.08 254.99,251.13 A01.K2
D01RETURN
  Top 0.254: A15.E1 84.49,262.88 85.44,261.93 85.44,237.16 87.03,235.57 A14.R2
  Bottom 0.254: 98.46,236.21 88.94,236.21 87.98,235.26 A14.R2 | 98.46,236.21 99.41,235.26 A13.R2 | 111.16,236.21 112.11,235.26 A12.R2 | 98.46,236.21 111.16,236.21 | 123.86,236.21 124.81,235.26 A11.R2 | 111.16,236.21 123.86,236.21 | 136.56,236.21 137.51,235.26 A10.R2 | 123.86,236.21 136.56,236.21 | 149.26,236.21 150.21,235.26 A09.R2 | 136.56,236.21 149.26,236.21 | 161.96,236.21 162.91,235.26 A08.R2 | 149.26,236.21 161.96,236.21 | 174.66,236.21 175.61,235.26 A07.R2 | 161.96,236.21 174.66,236.21 | 187.36,236.21 188.31,235.26 A06.R2 | 174.66,236.21 187.36,236.21 | 200.06,236.21 201.01,235.26 A05.R2 | 187.36,236.21 200.06,236.21 | 212.76,236.21 213.71,235.26 A04.R2 | 200.06,236.21 212.76,236.21 | 225.46,236.21 226.41,235.26 A03.R2 | 212.76,236.21 225.46,236.21 | 238.16,236.21 239.11,235.26 A02.R2 | 225.46,236.21 238.16,236.21 | 238.16,236.21 250.86,236.21 251.81,235.26 A01.R2
D01SELECTH  (via drill 0.61)
  Top 0.254: v61.63,65.71 63.54,67.61 63.54,115.56 64.81,116.83 C16.K2
  Bottom 0.254: v61.63,65.71 60.36,64.44 59.09,64.44 59.09,60.95 D17.E1
D01SELECTL  (via drill 0.61)
  Top 0.254: v60.04,80 60.04,70.47 57.5,67.93 57.5,59.36 55.92,57.77 D17.F1 | v36.87,85.39 34.64,87.62 34.64,151.12 32.1,153.66 v32.1,157.79
  Bottom 0.254: v60.04,80 54.33,85.71 47.34,85.71 47.03,85.39 v36.87,85.39 | v32.1,157.79 32.74,158.42 35.91,158.42 B18.T2
D01SELH  (via drill 0.61)
  Top 0.254: v56.87,29.83 60.04,33.01 60.04,65.08 59.09,66.03 D17.C1
  Bottom 0.254: v56.87,29.83 47.66,29.83 46.71,28.88 D18.S1
D01SELL  (via drill 0.61)
  Top 0.254: v8.93,51.1 8.93,75.24 7.97,76.19 7.97,153.34 v8.29,153.66
  Bottom 0.254: v8.93,51.1 27.02,33.01 37.18,33.01 37.82,32.37 41.95,32.37 42.26,32.06 D18.R1 | v8.29,153.66 12.74,153.66 15.91,150.48 47.03,150.48 48.61,152.07 B17.V2
D01SOURCE
  Bottom 0.254: A15.L1 81.63,247.32 86.71,247.32 A14.L2 87.98,247.96 88.94,248.91 98.46,248.91 | 98.46,248.91 99.41,247.96 A13.L2 | 111.16,248.91 112.11,247.96 A12.L2 | 98.46,248.91 111.16,248.91 | 123.86,248.91 124.81,247.96 A11.L2 | 111.16,248.91 123.86,248.91 | 136.56,248.91 137.51,247.96 A10.L2 | 123.86,248.91 136.56,248.91 | 149.26,248.91 150.21,247.96 A09.L2 | 136.56,248.91 149.26,248.91 | 161.96,248.91 162.91,247.96 A08.L2 | 149.26,248.91 161.96,248.91 | 174.66,248.91 175.61,247.96 A07.L2 | 161.96,248.91 174.66,248.91 | 187.36,248.91 188.31,247.96 A06.L2 | 174.66,248.91 187.36,248.91 | 200.06,248.91 201.01,247.96 A05.L2 | 187.36,248.91 200.06,248.91 | 212.76,248.91 213.71,247.96 A04.L2 | 200.06,248.91 212.76,248.91 | 225.46,248.91 226.41,247.96 A03.L2 | 212.76,248.91 225.46,248.91 | 238.16,248.91 239.11,247.96 A02.L2 | 225.46,248.91 238.16,248.91 | 238.16,248.91 250.86,248.91 251.81,247.96 A01.L2
D01STROBE
  Bottom 0.254: A15.P2 78.14,238.75 78.14,243.19 86.71,243.19 87.98,244.46 A14.M2 91.16,244.78 92.11,245.73 101.64,245.73 | 101.64,245.73 102.59,244.78 A13.M2 | 114.34,245.73 115.29,244.78 A12.M2 | 101.64,245.73 114.34,245.73 | 127.04,245.73 127.99,244.78 A11.M2 | 114.34,245.73 127.04,245.73 | 139.74,245.73 140.69,244.78 A10.M2 | 127.04,245.73 139.74,245.73 | 152.44,245.73 153.39,244.78 A09.M2 | 139.74,245.73 152.44,245.73 | 165.14,245.73 166.09,244.78 A08.M2 | 152.44,245.73 165.14,245.73 | 177.84,245.73 178.79,244.78 A07.M2 | 165.14,245.73 177.84,245.73 | 190.54,245.73 191.49,244.78 A06.M2 | 177.84,245.73 190.54,245.73 | 203.24,245.73 204.19,244.78 A05.M2 | 190.54,245.73 203.24,245.73 | 215.94,245.73 216.89,244.78 A04.M2 | 203.24,245.73 215.94,245.73 | 228.64,245.73 229.59,244.78 A03.M2 | 215.94,245.73 228.64,245.73 | 241.34,245.73 242.29,244.78 A02.M2 | 228.64,245.73 241.34,245.73 | 241.34,245.73 254.04,245.73 254.99,244.78 A01.M2
D01STROBEL  (via drill 0.61)
  Top 0.254: v63.22,156.2 63.22,178.42 60.68,180.96 60.68,191.12 69.57,200.01 69.57,203.82 63.54,209.86 63.54,220.97 63.22,221.29 63.22,231.76 64.17,232.71 64.17,236.84 64.81,237.48 A16.P2
  Bottom 0.254: B18.U2 40.36,155.88 41.31,156.83 54.65,156.83 55.6,155.88 58.14,155.88 B17.U1 59.41,155.24 62.27,155.24 v63.22,156.2
D01WRITE  (via drill 0.61)
  Top 0.254: v87.98,249.23 89.25,247.96 89.25,233.35 90.21,232.4 A14.S2
  Bottom 0.254: 101.64,233.03 92.11,233.03 91.16,232.08 A14.S2 | 101.64,233.03 102.59,232.08 A13.S2 | 114.34,233.03 115.29,232.08 A12.S2 | 101.64,233.03 114.34,233.03 | 127.04,233.03 127.99,232.08 A11.S2 | 114.34,233.03 127.04,233.03 | 139.74,233.03 140.69,232.08 A10.S2 | 127.04,233.03 139.74,233.03 | 152.44,233.03 153.39,232.08 A09.S2 | 139.74,233.03 152.44,233.03 | 165.14,233.03 166.09,232.08 A08.S2 | 152.44,233.03 165.14,233.03 | 177.84,233.03 178.79,232.08 A07.S2 | 165.14,233.03 177.84,233.03 | 190.54,233.03 191.49,232.08 A06.S2 | 177.84,233.03 190.54,233.03 | 203.24,233.03 204.19,232.08 A05.S2 | 190.54,233.03 203.24,233.03 | 215.94,233.03 216.89,232.08 A04.S2 | 203.24,233.03 215.94,233.03 | 228.64,233.03 229.59,232.08 A03.S2 | 215.94,233.03 228.64,233.03 | 241.34,233.03 242.29,232.08 A02.S2 | 228.64,233.03 241.34,233.03 | 241.34,233.03 254.04,233.03 254.99,232.08 A01.S2 | v87.98,249.23 74.97,249.23 74.97,253.35 A15.J2
D01WRITEH  (via drill 0.61)
  Top 0.254: v60.36,129.53 60.04,129.21 60.04,100 59.09,99.05 C17.S1 | B16.L2 61.63,177.15 60.68,176.2 60.68,151.43 63.22,148.89 63.22,134.93 62.27,133.97 C16.D2
  Bottom 0.254: B16.L2 62.58,178.11 64.81,180.33 B16.K2 | v60.36,129.53 60.36,133.02 61.31,133.02 C16.D2
D02MEM0
  Top 0.254: B20.D1 17.82,197.47 19.4,199.06 19.4,207 22.26,209.86 22.26,220.02 21.31,220.97 21.31,224.14 21.94,224.78 21.94,260.34 23.21,261.61 25.75,261.61 25.75,256.53 26.39,255.89 35.28,255.89 35.28,260.97 36.55,262.24 51.79,262.24 51.79,263.19 A17N.E2
D02MEM1  (via drill 0.61)
  Top 0.254: v45.12,195.57 44.8,195.89 44.8,228.59 51.15,234.94 51.15,255.58 52.11,256.53 A17N.H2
  Bottom 0.254: v45.12,195.57 35.91,195.57 35.6,195.89 34.33,195.89 34.01,195.57 28.61,195.57 27.98,194.93 22.26,194.93 21.31,193.98 B20.E1
D02MEM2  (via drill 0.61)
  Top 0.254: v7.02,182.87 7.34,183.18 7.34,209.22 7.02,209.54 7.02,229.22 6.39,229.86 6.39,235.89 7.34,236.84 v7.34,241.92
  Bottom 0.254: v7.02,182.87 15.91,182.87 17.82,180.96 B20.K1 | v7.34,241.92 11.78,246.37 46.07,246.37 50.2,250.49 51.79,250.49 A17N.K2
D02MEM3  (via drill 0.61)
  Top 0.254: v8.29,179.06 8.61,179.37 8.61,209.22 8.29,209.54 v8.29,237.48
  Bottom 0.254: v8.29,179.06 15.91,179.06 16.86,178.11 B20.L1 | v8.29,237.48 10.83,240.02 33.37,240.02 36.55,243.19 50.84,243.19 51.79,244.14 A17N.M2
D02MEM4  (via drill 0.61)
  Top 0.254: v6.39,166.68 6.7,166.99 6.7,181.92 6.07,182.55 6.07,185.09 6.7,185.73 6.7,209.22 6.39,209.54 6.39,228.59 v6.07,228.9
  Bottom 0.254: v6.39,166.68 11.47,166.68 12.1,166.04 16.23,166.04 16.86,165.4 B20.R1 | v6.07,228.9 6.07,236.52 50.52,236.52 51.79,237.8 A17N.P2
D02MEM5  (via drill 0.61)
  Top 0.254: v7.34,165.72 7.34,181.92 7.97,182.55 7.97,209.22 7.66,209.54 7.66,229.86 v7.34,230.18
  Bottom 0.254: v7.34,165.72 9.24,163.82 14.32,163.82 16.23,161.91 B20.S1 | v7.34,230.18 7.66,230.49 50.84,230.49 51.79,231.45 A17N.S2
D02MEM6  (via drill 0.61)
  Top 0.254: v15.28,208.58 15.59,208.27 15.59,205.73 14.96,205.09 14.96,203.82 13.05,201.92 13.05,188.9 14.01,187.95 B20.H2 | v47.66,208.9 47.34,209.22 47.34,226.36 48.93,227.95 A17N.T2
  Bottom 0.254: v15.28,208.58 15.59,208.9 v47.66,208.9
D02MEM7  (via drill 0.61)
  Top 0.254: v17.18,220.65 12.42,215.89 12.42,185.73 11.47,184.77 B20.J2
  Bottom 0.254: v17.18,220.65 17.5,220.33 47.03,220.33 48.61,221.92 A17N.V2
D02MEM8  (via drill 0.61)
  Top 0.254: v2.26,171.44 1.31,172.39 1.31,235.26 3.53,237.48 v3.53,243.83
  Bottom 0.254: v3.53,243.83 27.66,267.96 60.36,267.96 61.31,267 A16.D2 | v2.26,171.44 B20.N2
D02MEM9  (via drill 0.61)
  Top 0.254: v37.5,175.56 37.82,175.88 37.82,189.85 v38.14,190.17 | v52.74,198.43 54.33,200.01 v54.33,206.05 | v60.36,207.31 60.68,207.63 60.68,231.76 63.54,234.62 63.54,261.61 64.81,262.88 A16.E2
  Bottom 0.254: v37.5,175.56 28.93,166.99 20.04,166.99 19.72,167.31 15.59,167.31 14.96,167.95 B20.P2 | v38.14,190.17 40.36,192.39 46.71,192.39 v52.74,198.43 | v54.33,206.05 55.92,207.63 60.04,207.63 v60.36,207.31
D02MEM10  (via drill 0.61)
  Top 0.254: v17.18,179.37 15.59,177.79 15.59,157.15 14.64,156.2 B20.U2 | v10.2,194.61 9.88,194.93 9.88,209.22 10.2,209.54 10.2,221.29 9.88,221.6 v9.88,248.91
  Bottom 0.254: v17.18,179.37 16.86,179.69 8.93,179.69 3.85,184.77 3.85,194.61 v10.2,194.61 | v9.88,248.91 16.86,255.89 63.54,255.89 64.49,256.85 A16.H2
D02MEM11  (via drill 0.61)
  Top 0.254: v41.95,147.94 41.63,148.26 41.63,179.06 44.8,182.23 44.8,190.49 47.98,193.66 v47.98,205.41 | v61.63,207.31 61.95,207.63 v61.95,216.21 | v64.49,218.74 64.17,219.06 64.17,224.46 63.85,224.78 63.85,228.59 66.39,231.13 66.39,249.23 65.44,250.18 A16.K2
  Bottom 0.254: v41.95,147.94 14.64,147.94 14.64,149.53 13.69,150.48 13.37,150.48 11.78,152.07 B20.V2 | v47.98,205.41 48.3,205.09 59.41,205.09 v61.63,207.31 | v61.95,216.21 v64.49,218.74
D03BEMA0L  (via drill 0.61)
  Top 0.254: v89.57,32.06 91.79,34.28 91.79,38.72 128.94,75.87 v128.94,76.5 | v149.9,85.71 155.93,91.74 155.93,209.54 158.79,212.39 158.79,224.46 152.12,231.13 152.12,265.1 151.17,266.05 A09.D2
  Bottom 0.254: 98.46,267.96 88.94,267.96 87.98,267 A14.D2 | 98.46,267.96 99.41,267 A13.D2 | 111.16,267.96 112.11,267 A12.D2 | 111.16,267.96 98.46,267.96 | 123.86,267.96 124.81,267 A11.D2 | 123.86,267.96 111.16,267.96 | 123.86,267.96 136.56,267.96 137.51,267 A10.D2 138.78,267 139.74,267.96 152.44,267.96 | v89.57,32.06 78.46,20.94 75.92,20.94 73.38,23.48 64.49,23.48 64.17,23.16 60.04,23.16 59.41,22.53 D17.U1 | v128.94,76.5 138.15,85.71 v149.9,85.71 | 161.96,267.96 162.91,267 A08.D2 | 161.96,267.96 152.44,267.96 | 152.44,267.96 151.48,267 A09.D2 | 174.66,267.96 175.61,267 A07.D2 | 174.66,267.96 161.96,267.96 | 187.36,267.96 188.31,267 A06.D2 | 187.36,267.96 174.66,267.96 | 200.06,267.96 201.01,267 A05.D2 | 200.06,267.96 187.36,267.96 | 212.76,267.96 213.71,267 A04.D2 | 212.76,267.96 200.06,267.96 | 225.46,267.96 226.41,267 A03.D2 | 225.46,267.96 212.76,267.96 | 238.16,267.96 239.11,267 A02.D2 | 238.16,267.96 225.46,267.96 | 238.16,267.96 250.86,267.96 251.81,267 A01.D2
D03BEMA1L  (via drill 0.61)
  Top 0.254: v55.92,16.82 51.15,21.58 51.15,29.51 49.57,31.1 D17.R2 | v109.89,19.35 165.14,74.6 165.14,152.07 218.79,205.73 218.79,209.54 215.94,212.39 215.94,261.61 217.21,262.88 A04.E2
  Bottom 0.254: 101.64,264.78 92.11,264.78 91.16,263.83 A14.E2 | 101.64,264.78 102.59,263.83 A13.E2 | 114.34,264.78 115.29,263.83 A12.E2 | 114.34,264.78 101.64,264.78 | 127.04,264.78 127.99,263.83 A11.E2 | 127.04,264.78 114.34,264.78 | 139.74,264.78 140.69,263.83 A10.E2 | 139.74,264.78 127.04,264.78 | 152.44,264.78 153.39,263.83 A09.E2 | 152.44,264.78 139.74,264.78 | 165.14,264.78 166.09,263.83 A08.E2 | 165.14,264.78 152.44,264.78 | 177.84,264.78 178.79,263.83 A07.E2 | 177.84,264.78 165.14,264.78 | 190.54,264.78 191.49,263.83 A06.E2 | 190.54,264.78 177.84,264.78 | 190.54,264.78 203.24,264.78 204.19,263.83 A05.E2 205.46,263.83 206.41,264.78 219.11,264.78 | v55.92,16.82 56.23,17.13 107.67,17.13 v109.89,19.35 | 228.64,264.78 229.59,263.83 A03.E2 | 228.64,264.78 219.11,264.78 | 219.11,264.78 218.16,263.83 A04.E2 | 241.34,264.78 242.29,263.83 A02.E2 | 241.34,264.78 228.64,264.78 | 241.34,264.78 254.04,264.78 254.99,263.83 A01.E2
D03BEMA2L  (via drill 0.61)
  Top 0.254: v50.84,18.72 51.47,18.72 60.04,10.15 98.78,10.15 98.78,22.21 145.77,69.2 145.77,135.56 143.23,138.1 143.23,207.95 143.55,208.27 143.55,221.29 142.59,222.24 142.59,255.58 141.64,256.53 A10.H2
  Bottom 0.254: 165.14,258.43 155.61,258.43 154.66,257.48 A09.H2 153.39,257.48 152.75,258.11 148.63,258.11 148.31,258.43 139.74,258.43 | 165.14,258.43 166.09,257.48 A08.H2 | 177.84,258.43 178.79,257.48 A07.H2 | 177.84,258.43 165.14,258.43 | 190.54,258.43 191.49,257.48 A06.H2 | 190.54,258.43 177.84,258.43 | 203.24,258.43 204.19,257.48 A05.H2 | 203.24,258.43 190.54,258.43 | 215.94,258.43 216.89,257.48 A04.H2 | 215.94,258.43 203.24,258.43 | 228.64,258.43 229.59,257.48 A03.H2 | 228.64,258.43 215.94,258.43 | 241.34,258.43 242.29,257.48 A02.H2 | 241.34,258.43 228.64,258.43 | 241.34,258.43 254.04,258.43 254.99,257.48 A01.H2 | 101.64,258.43 92.11,258.43 91.16,257.48 A14.H2 | 101.64,258.43 102.59,257.48 A13.H2 | 114.34,258.43 115.29,257.48 A12.H2 | 114.34,258.43 101.64,258.43 | 114.34,258.43 127.04,258.43 127.99,257.48 A11.H2 129.26,257.48 130.21,258.43 139.74,258.43 | v50.84,18.72 54.96,18.72 D17.V1 | 139.74,258.43 140.69,257.48 A10.H2
D03BMA0  (via drill 0.61)
  Top 0.254: v65.44,252.4 70.2,247.64 70.2,234.3 70.52,233.99 70.52,232.71 70.2,232.4 70.2,221.6 73.38,218.43 73.38,198.43 74.33,197.47 B15.D2
  Bottom 0.254: v65.44,252.4 16.23,252.4 14.96,251.13 A20N.K2
D03BMA1  (via drill 0.61)
  Top 0.254: v79.09,219.06 79.09,186.68 78.14,185.73 78.14,181.6 B15.K2 | v12.74,219.7 12.42,220.02 12.42,242.24 14.01,243.83 A20N.M2
  Bottom 0.254: v79.09,219.06 78.46,219.7 v12.74,219.7
D03BMA2  (via drill 0.61)
  Top 0.254: v66.71,166.99 66.39,167.31 66.39,176.52 v62.9,180.01 | v50.2,181.28 50.52,181.6 50.52,204.77 45.76,209.54 v45.76,216.84 | v14.01,218.74 13.69,219.06 13.69,224.14 13.05,224.78 13.05,236.52 14.01,237.48 A20N.P2
  Bottom 0.254: v66.71,166.99 72.11,166.99 73.38,168.26 74.65,168.26 B15.R2 | v62.9,180.01 62.58,179.69 51.79,179.69 v50.2,181.28 | v45.76,216.84 43.53,219.06 14.32,219.06 v14.01,218.74
D03BMA3  (via drill 0.61)
  Top 0.254: v82.59,170.8 82.27,170.49 82.27,145.08 83.86,143.5 C15.A1 | v81.95,173.66 82.27,173.98 82.27,181.6 82.9,182.23 82.9,207.31 80.05,210.17 80.05,219.7 71.16,228.59 v71.16,229.86
  Bottom 0.254: v82.59,170.8 82.59,173.66 v81.95,173.66 | v71.16,229.86 67.98,233.03 15.91,233.03 14.96,232.08 A20N.S2
D03BMA4  (via drill 0.61)
  Top 0.254: v81.95,129.84 81.95,128.26 81.32,127.62 C15.F1 | v147.04,134.93 145.77,136.2 145.77,269.55 v136.88,278.43 | v15.59,260.97 v15.59,229.54
  Bottom 0.254: v81.95,129.84 87.35,135.24 146.72,135.24 v147.04,134.93 | v136.88,278.43 136.56,278.12 32.74,278.12 v15.59,260.97 | v15.59,229.54 14.96,228.9 11.78,228.9 A20N.T2
D03BMA5  (via drill 0.61)
  Top 0.254: v14.64,222.55 19.4,227.32 19.4,258.43 23.21,262.24 31.47,262.24 31.47,264.15 46.07,278.75 132.43,278.75 132.43,274.31 133.7,273.04 v133.7,217.48 | v142.59,208.58 v142.59,108.89
  Bottom 0.254: v14.64,222.55 11.78,222.55 A20N.V2 | v133.7,217.48 v142.59,208.58 | v142.59,108.89 142.28,109.21 86.4,109.21 84.81,110.8 C15.M1
D03BMA6  (via drill 0.61)
  Top 0.254: v101.64,270.5 102.27,271.13 105.45,271.13 105.45,270.18 126.72,248.91 126.72,199.06 127.35,198.43 127.35,150.48 v127.67,150.17 | v75.28,145.4 73.38,143.5 73.38,134.93 74.33,133.97 C15.D2
  Bottom 0.254: v101.64,270.5 99.73,268.59 26.07,268.59 24.48,267 A19N.D2 | v127.67,150.17 124.5,146.99 112.43,146.99 112.11,146.67 88.3,146.67 87.03,145.4 v75.28,145.4
D03BMA7  (via drill 0.61)
  Top 0.254: v136.24,159.69 136.24,271.13 133.07,274.31 133.07,281.61 48.3,281.61 30.52,263.83 27.66,263.83 A19N.E2 | v84.49,160.01 83.86,159.37 v83.86,157.47 | v71.79,153.98 67.03,149.21 67.03,120 v68.62,118.41
  Bottom 0.254: v136.24,159.69 135.93,160.01 v84.49,160.01 | v83.86,157.47 83.22,156.83 76.87,156.83 74.01,153.98 v71.79,153.98 | v68.62,118.41 68.93,118.73 76.24,118.73 77.19,117.78 C15.K2
D03BMA8  (via drill 0.61)
  Top 0.254: v135.29,214.62 130.53,219.38 130.53,278.12 46.07,278.12 32.1,264.15 32.1,257.48 27.66,257.48 A19N.H2 | v140.37,209.54 140.05,209.22 140.05,86.98 v140.37,86.66 | v84.17,85.39 82.27,87.3 82.27,95.87 v80.68,97.46
  Bottom 0.254: v135.29,214.62 v140.37,209.54 | v140.37,86.66 140.05,86.98 101.32,86.98 99.73,85.39 v84.17,85.39 | v80.68,97.46 76.87,101.27 75.28,101.27 C15.R2
D03BMA9  (via drill 0.61)
  Top 0.254: v30.52,192.71 28.93,194.3 28.93,201.6 25.75,204.77 25.75,222.24 22.58,225.41 22.58,229.22 25.12,231.76 25.12,248.59 26.71,250.18 A19N.K2 | v38.14,191.76 39.09,190.8 39.09,188.58 38.45,187.95 38.45,166.04 v40.04,164.45 | v47.03,163.5 47.34,163.18 47.34,149.21 50.2,146.36 v50.2,143.18
  Bottom 0.254: v30.52,192.71 31.47,191.76 v38.14,191.76 | v40.04,164.45 40.99,163.5 v47.03,163.5 | v50.2,143.18 51.79,141.59 69.89,141.59 70.84,142.55 C16.A1
D03BMA10  (via drill 0.61)
  Top 0.254: v29.25,205.09 28.93,205.41 28.93,225.41 25.75,228.59 25.75,242.87 26.71,243.83 A19N.M2 | v25.12,200.96 25.12,181.6 v24.8,181.28 | v28.93,174.61 28.93,170.17 29.25,169.85 29.25,166.04 28.93,165.72 28.93,132.7 v31.79,129.84
  Bottom 0.254: v29.25,205.09 v25.12,200.96 | v24.8,181.28 27.02,179.06 30.83,179.06 31.47,178.42 31.47,176.52 30.83,176.52 v28.93,174.61 | v31.79,129.84 32.74,128.89 47.03,128.89 47.66,128.26 66.71,128.26 67.66,127.3 C16.F1
D03BMA11  (via drill 0.61)
  Top 0.254: v69.57,233.67 69.57,220.97 v72.11,218.43 | v115.92,209.86 123.54,202.24 v123.54,146.04 | v90.84,145.72 89.25,144.13 89.25,107.3 v89.57,106.99
  Bottom 0.254: v69.57,233.67 67.66,233.67 61.95,239.38 28.61,239.38 27.66,238.43 A19N.P2 | v72.11,218.43 72.43,218.11 93.7,218.11 94.65,219.06 106.72,219.06 v115.92,209.86 | v123.54,146.04 123.23,145.72 v90.84,145.72 | v89.57,106.99 88.3,106.99 87.98,106.67 77.82,106.67 73.7,110.8 72.11,110.8 C16.M1
D03BTP2  (via drill 0.61)
  Top 0.254: v37.5,65.71 37.82,66.03 37.82,117.46 35.28,120 35.28,134.29 v36.87,135.88 | v62.9,206.68 62.9,220.97 62.27,221.6 A16.V2 | v43.22,201.28 41.95,200.01 41.95,198.43 40.99,197.47 v40.99,138.42
  Bottom 0.254: v37.5,65.71 39.09,64.12 41.95,64.12 42.26,63.81 D18.D1 | v36.87,135.88 39.41,138.42 v40.99,138.42 54.01,138.42 54.96,139.37 C17.B1 | v62.9,206.68 60.68,204.46 46.39,204.46 v43.22,201.28
D03EA0  (via drill 0.61)
  Top 0.254: v82.59,260.97 82.27,260.66 82.27,255.58 82.59,255.26 82.59,208.27 83.86,207 B15.A1
  Bottom 0.254: v82.59,260.97 78.14,265.42 38.14,265.42 37.18,266.37 A18N.D2
D03EA1  (via drill 0.61)
  Top 0.254: v57.19,191.76 56.87,192.08 56.87,213.03 57.19,213.35 57.19,260.66 53.06,264.78 40.04,264.78 40.04,264.15 A18N.E2
  Bottom 0.254: v57.19,191.76 79.41,191.76 80.36,190.8 B15.F1
D03EA2  (via drill 0.61)
  Top 0.254: v89.57,176.52 89.25,176.83 89.25,228.9 v89.57,229.22 | v46.39,242.24 40.99,247.64 40.99,255.58 40.04,256.53 A18N.H2
  Bottom 0.254: v89.57,176.52 86.4,176.52 84.81,174.93 B15.M1 | v89.57,229.22 88.94,229.86 76.55,229.86 66.39,240.02 48.61,240.02 v46.39,242.24
D03EMA0H  (via drill 0.61)
  Top 0.254: D18.F2 36.23,56.5 34.01,54.28 D19.H1 33.69,53.33 33.69,51.74 37.82,47.61 37.82,41.26 v42.9,36.18 | v85.13,196.84 87.67,199.38 v87.67,200.33 | v118.78,200.65 120.69,198.74 120.69,86.03 123.86,82.86 123.86,77.14 114.02,67.3 114.02,61.58 94.33,41.9 92.43,41.9 v92.43,47.61 | v59.09,38.4 59.09,35.55 D17.P1
  Bottom 0.254: v42.9,36.18 57.19,36.18 58.14,35.23 D17.P1 | v85.13,196.84 83.86,195.57 72.11,195.57 69.57,198.11 61.31,198.11 60.36,197.15 56.23,197.15 B17.D1 | v87.67,200.33 88.62,201.28 92.43,201.28 92.75,200.96 95.92,200.96 96.24,201.28 105.13,201.28 105.45,200.96 108.62,200.96 108.94,201.28 117.83,201.28 118.46,200.65 v118.78,200.65 | v92.43,47.61 91.16,48.88 87.35,48.88 84.17,45.71 66.39,45.71 v59.09,38.4
D03EMA0L  (via drill 0.61)
  Top 0.254: D18.E2 40.04,60.95 40.04,61.9 41.63,63.49 41.63,66.35 45.44,66.35 D18.C1 46.39,67.3 46.71,67.61 v46.71,69.2 | v60.04,195.25 60.04,204.77 59.09,205.73 B17.A1 | v112.43,73.33 114.02,74.92 114.02,190.8 v114.34,191.12
  Bottom 0.254: D19.J1 30.52,51.42 30.52,55.87 33.37,55.87 37.5,60 39.09,60 D18.E2 | v60.04,195.25 60.36,194.93 82.59,194.93 83.54,193.98 B15.E1 84.81,193.34 85.76,192.39 91.16,192.39 91.79,193.03 93.38,193.03 94.65,191.76 113.7,191.76 v114.34,191.12 | v46.71,69.2 48.61,71.11 94.65,71.11 95.29,71.74 110.84,71.74 v112.43,73.33
D03EMA1H  (via drill 0.61)
  Top 0.254: v40.99,61.58 44.8,57.77 44.8,49.2 45.76,48.25 D18.K1 | v66.71,192.71 67.03,192.39 67.03,182.23 v67.98,181.28 | v64.17,177.47 63.85,177.15 63.85,160.01 v66.08,157.79 | v73.06,151.75 76.24,148.58 76.24,144.45 75.92,144.13 v75.92,124.77 | v40.04,109.52 40.99,108.57 40.99,64.76 v39.41,63.17
  Bottom 0.254: 39.41,61.58 v40.99,61.58 | 39.41,61.58 34.96,61.58 34.01,60.63 D19.E1 | D17.M2 52.11,41.9 52.11,46.34 47.66,46.34 46.71,47.29 D18.K1 | v66.71,192.71 66.39,192.39 60.36,192.39 59.41,193.34 B17.E1 | v67.98,181.28 v64.17,177.47 | v66.08,157.79 69.57,154.29 70.2,154.29 72.74,151.75 v73.06,151.75 | v75.92,124.77 70.52,119.37 51.15,119.37 50.84,119.69 50.2,119.69 v40.04,109.52 | v39.41,63.17 39.41,61.58
D03EMA1L  (via drill 0.61)
  Top 0.254: v31.79,53.64 31.79,61.58 30.52,62.85 D19.D1 29.88,64.12 28.93,65.08 28.93,85.71 32.1,88.89 v32.1,95.24 | v81.63,200.33 82.27,199.7 82.27,182.23 81.32,181.28 81.32,178.42 B15.L1 | v92.75,119.05 92.43,119.37 92.43,149.53 93.06,150.17 93.06,151.12 92.43,151.75 92.43,172.07 v93.38,173.02
  Bottom 0.254: v31.79,53.64 33.37,52.06 41.31,52.06 42.26,51.1 D18.J1 | v81.63,200.33 80.68,201.28 57.82,201.28 56.23,202.87 B17.B1 | v32.1,95.24 37.18,100.32 51.79,100.32 54.96,103.49 59.41,103.49 67.03,111.11 67.03,116.19 87.35,116.19 90.21,119.05 v92.75,119.05 | v93.38,173.02 93.06,173.34 83.54,173.34 81.32,175.56 81.32,177.15 B15.L1
D03EMA2H
  Top 0.254: D17.T2 48.93,26.02 47.34,27.61 47.34,30.47 36.87,40.95 36.87,43.8 D18.L2
  Bottom 0.254: D19.L1 30.83,44.12 35.91,44.12 D18.L2
D03EMA2L  (via drill 0.61)
  Top 0.254: v83.22,147.62 82.9,147.94 82.9,160.33 83.86,161.28 B15.S1 | v53.06,148.58 51.79,149.85 v51.79,151.12 | v15.59,148.89 13.69,146.99 13.69,145.08 9.24,140.64 9.24,75.55 9.88,74.92 v9.88,67.3
  Bottom 0.254: 39.41,46.34 39.41,46.98 D18.K2 | 39.41,46.34 39.41,45.39 37.18,43.17 35.6,43.17 34.01,41.58 D19.M1 | v83.22,147.62 82.59,146.99 61.31,146.99 61,146.67 54.96,146.67 v53.06,148.58 | v51.79,151.12 49.57,148.89 v15.59,148.89 | v9.88,67.3 30.83,46.34 39.41,46.34
D03MA0L  (via drill 0.61)
  Top 0.254: v90.21,182.87 92.11,184.77 92.11,207.95 92.75,208.58 92.75,221.29 92.43,221.6 92.43,244.46 94.97,247 94.97,265.1 94.02,266.05 A14.D1
  Bottom 0.254: v90.21,182.87 80.36,182.87 80.05,183.18 75.92,183.18 75.28,183.82 B15.J2 | 104.81,265.42 105.76,266.37 A13.D1 | 104.81,265.42 95.29,265.42 94.33,266.37 A14.D1 | 117.51,265.42 118.46,266.37 A12.D1 | 117.51,265.42 104.81,265.42 | 130.21,265.42 131.16,266.37 A11.D1 | 130.21,265.42 117.51,265.42 | 142.91,265.42 143.86,266.37 A10.D1 | 142.91,265.42 130.21,265.42 | 155.61,265.42 156.56,266.37 A09.D1 | 155.61,265.42 142.91,265.42 | 168.31,265.42 169.26,266.37 A08.D1 | 168.31,265.42 155.61,265.42 | 181.01,265.42 181.96,266.37 A07.D1 | 181.01,265.42 168.31,265.42 | 193.71,265.42 194.66,266.37 A06.D1 | 193.71,265.42 181.01,265.42 | 206.41,265.42 207.36,266.37 A05.D1 | 206.41,265.42 193.71,265.42 | 219.11,265.42 220.06,266.37 A04.D1 | 219.11,265.42 206.41,265.42 | 231.81,265.42 232.76,266.37 A03.D1 | 231.81,265.42 219.11,265.42 | 244.51,265.42 245.46,266.37 A02.D1 | 244.51,265.42 231.81,265.42 | 244.51,265.42 257.21,265.42 258.16,266.37 A01.D1
D03MA1L  (via drill 0.61)
  Top 0.254: v108.62,170.49 110.84,172.71 110.84,259.7 109.57,260.97 A13.E1
  Bottom 0.254: v108.62,170.49 108.3,170.17 90.52,170.17 89.25,168.9 87.67,168.9 85.76,166.99 79.41,166.99 78.46,167.95 B15.P2 | 107.99,262.24 98.46,262.24 97.51,263.19 A14.E1 | 107.99,262.24 108.94,263.19 A13.E1 | 120.69,262.24 121.64,263.19 A12.E1 | 120.69,262.24 107.99,262.24 | 133.39,262.24 134.34,263.19 A11.E1 | 133.39,262.24 120.69,262.24 | 146.09,262.24 147.04,263.19 A10.E1 | 146.09,262.24 133.39,262.24 | 158.79,262.24 159.74,263.19 A09.E1 | 158.79,262.24 146.09,262.24 | 171.49,262.24 172.44,263.19 A08.E1 | 171.49,262.24 158.79,262.24 | 184.19,262.24 185.14,263.19 A07.E1 | 184.19,262.24 171.49,262.24 | 196.89,262.24 197.84,263.19 A06.E1 | 196.89,262.24 184.19,262.24 | 209.59,262.24 210.54,263.19 A05.E1 | 209.59,262.24 196.89,262.24 | 222.29,262.24 223.24,263.19 A04.E1 | 222.29,262.24 209.59,262.24 | 234.99,262.24 235.94,263.19 A03.E1 | 234.99,262.24 222.29,262.24 | 247.69,262.24 248.64,263.19 A02.E1 | 247.69,262.24 234.99,262.24 | 247.69,262.24 260.39,262.24 261.34,263.19 A01.E1
D03MA2L  (via drill 0.61)
  Top 0.254: v101,150.17 101.32,150.48 101.32,206.36 98.46,209.22 98.46,221.29 98.78,221.6 98.78,254.94 97.19,256.53 A14.H1
  Bottom 0.254: v101,150.17 94.02,150.17 92.75,151.43 91.79,151.43 91.48,151.12 76.24,151.12 75.28,152.07 B15.V2 | 107.99,255.89 108.94,256.85 A13.H1 | 107.99,255.89 98.46,255.89 97.51,256.85 A14.H1 | 120.69,255.89 121.64,256.85 A12.H1 | 120.69,255.89 107.99,255.89 | 133.39,255.89 134.34,256.85 A11.H1 | 133.39,255.89 120.69,255.89 | 146.09,255.89 147.04,256.85 A10.H1 | 146.09,255.89 133.39,255.89 | 158.79,255.89 159.74,256.85 A09.H1 | 158.79,255.89 146.09,255.89 | 171.49,255.89 172.44,256.85 A08.H1 | 171.49,255.89 158.79,255.89 | 184.19,255.89 185.14,256.85 A07.H1 | 184.19,255.89 171.49,255.89 | 196.89,255.89 197.84,256.85 A06.H1 | 196.89,255.89 184.19,255.89 | 209.59,255.89 210.54,256.85 A05.H1 | 209.59,255.89 196.89,255.89 | 222.29,255.89 223.24,256.85 A04.H1 | 222.29,255.89 209.59,255.89 | 234.99,255.89 235.94,256.85 A03.H1 | 234.99,255.89 222.29,255.89 | 247.69,255.89 248.64,256.85 A02.H1 | 247.69,255.89 234.99,255.89 | 247.69,255.89 260.39,255.89 261.34,256.85 A01.H1
D03MA3L  (via drill 0.61)
  Top 0.254: v102.27,127.94 101.95,128.26 101.95,203.19 107.99,209.22 107.99,252.08 106.72,253.35 A13.J1
  Bottom 0.254: v102.27,127.94 101.32,128.89 85.76,128.89 84.81,129.84 C15.E1 | 104.81,252.72 95.29,252.72 94.33,253.67 A14.J1 | 104.81,252.72 105.76,253.67 A13.J1 | 117.51,252.72 118.46,253.67 A12.J1 | 117.51,252.72 104.81,252.72 | 130.21,252.72 131.16,253.67 A11.J1 | 130.21,252.72 117.51,252.72 | 142.91,252.72 143.86,253.67 A10.J1 | 142.91,252.72 130.21,252.72 | 155.61,252.72 156.56,253.67 A09.J1 | 155.61,252.72 142.91,252.72 | 168.31,252.72 169.26,253.67 A08.J1 | 168.31,252.72 155.61,252.72 | 181.01,252.72 181.96,253.67 A07.J1 | 181.01,252.72 168.31,252.72 | 193.71,252.72 194.66,253.67 A06.J1 | 193.71,252.72 181.01,252.72 | 206.41,252.72 207.36,253.67 A05.J1 | 206.41,252.72 193.71,252.72 | 219.11,252.72 220.06,253.67 A04.J1 | 219.11,252.72 206.41,252.72 | 231.81,252.72 232.76,253.67 A03.J1 | 231.81,252.72 219.11,252.72 | 244.51,252.72 245.46,253.67 A02.J1 | 244.51,252.72 231.81,252.72 | 244.51,252.72 257.21,252.72 258.16,253.67 A01.J1
D03MA4L  (via drill 0.61)
  Top 0.254: v102.91,115.24 104.49,116.83 104.49,194.61 106.08,196.2 B13.D1